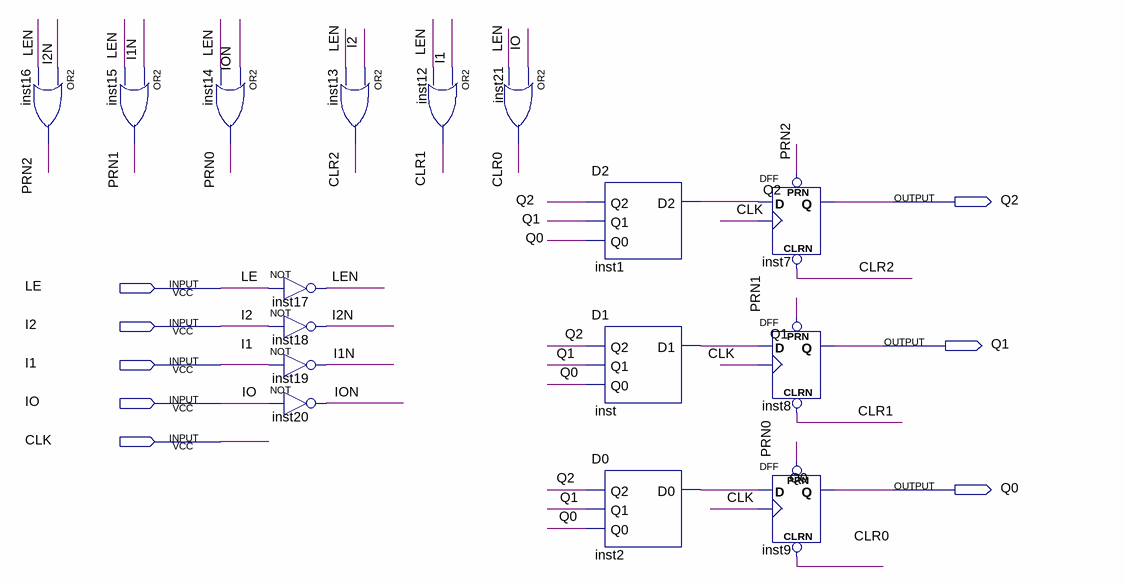
[diagram p0: schematic sheet]
// Quartus schematic D.bdf as structural Verilog: 16 symbols, 8 pins
module D (
  input  LE,
  input  I2,
  input  I1,
  input  IO,
  input  CLK,
  output Q2,
  output Q1,
  output Q0
);

  wire CLR0, CLR1, CLR2, I1N, I2N, inst1_d2, inst2_d0, inst_d1, ION, LEN, PRN0, PRN1, PRN2;

  or inst16 (PRN2, I2N, LEN);
  or inst15 (PRN1, I1N, LEN);
  or inst14 (PRN0, ION, LEN);
  not inst17 (LEN, LE);
  not inst18 (I2N, I2);
  not inst19 (I1N, I1);
  not inst20 (ION, IO);
  or inst13 (CLR2, I2, LEN);
  or inst12 (CLR1, I1, LEN);
  or inst21 (CLR0, IO, LEN);
  D2 inst1 (.Q2(Q2), .Q1(Q1), .Q0(Q0), .D2(inst1_d2));
  D1 inst (.Q2(Q2), .Q1(Q1), .Q0(Q0), .D1(inst_d1));
  D0 inst2 (.Q2(Q2), .Q1(Q1), .Q0(Q0), .D0(inst2_d0));
  DFF inst7 (.CLRN(CLR2), .CLK(CLK), .D(inst1_d2), .PRN(PRN2), .Q(Q2));
  DFF inst8 (.CLRN(CLR1), .CLK(CLK), .D(inst_d1), .PRN(PRN1), .Q(Q1));
  DFF inst9 (.CLRN(CLR0), .CLK(CLK), .D(inst2_d0), .PRN(PRN0), .Q(Q0));
endmodule
